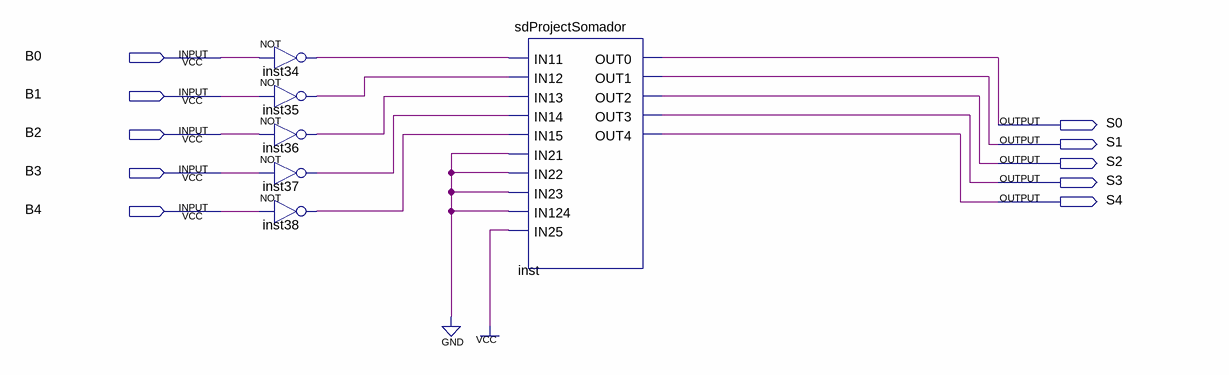
[diagram p0: schematic sheet]
// Quartus schematic sdProjectComplemento.bdf as structural Verilog: 6 symbols, 10 pins
module sdProjectComplemento (
  input  B0,
  input  B1,
  input  B2,
  input  B3,
  input  B4,
  output S0,
  output S1,
  output S2,
  output S3,
  output S4
);

  wire inst34_out, inst35_out, inst36_out, inst37_out, inst38_out;

  not inst34 (inst34_out, B0);
  not inst35 (inst35_out, B1);
  not inst36 (inst36_out, B2);
  not inst37 (inst37_out, B3);
  not inst38 (inst38_out, B4);
  sdProjectSomador inst (
    .IN11(inst34_out), .IN12(inst35_out), .IN13(inst36_out), .IN14(inst37_out), .IN15(inst38_out),
    .IN21(1'b0), .IN22(1'b0), .IN23(1'b0), .IN124(1'b0), .IN25(1'b1), .OUT0(S0), .OUT1(S1), .OUT2(S2),
    .OUT3(S3), .OUT4(S4));
endmodule
